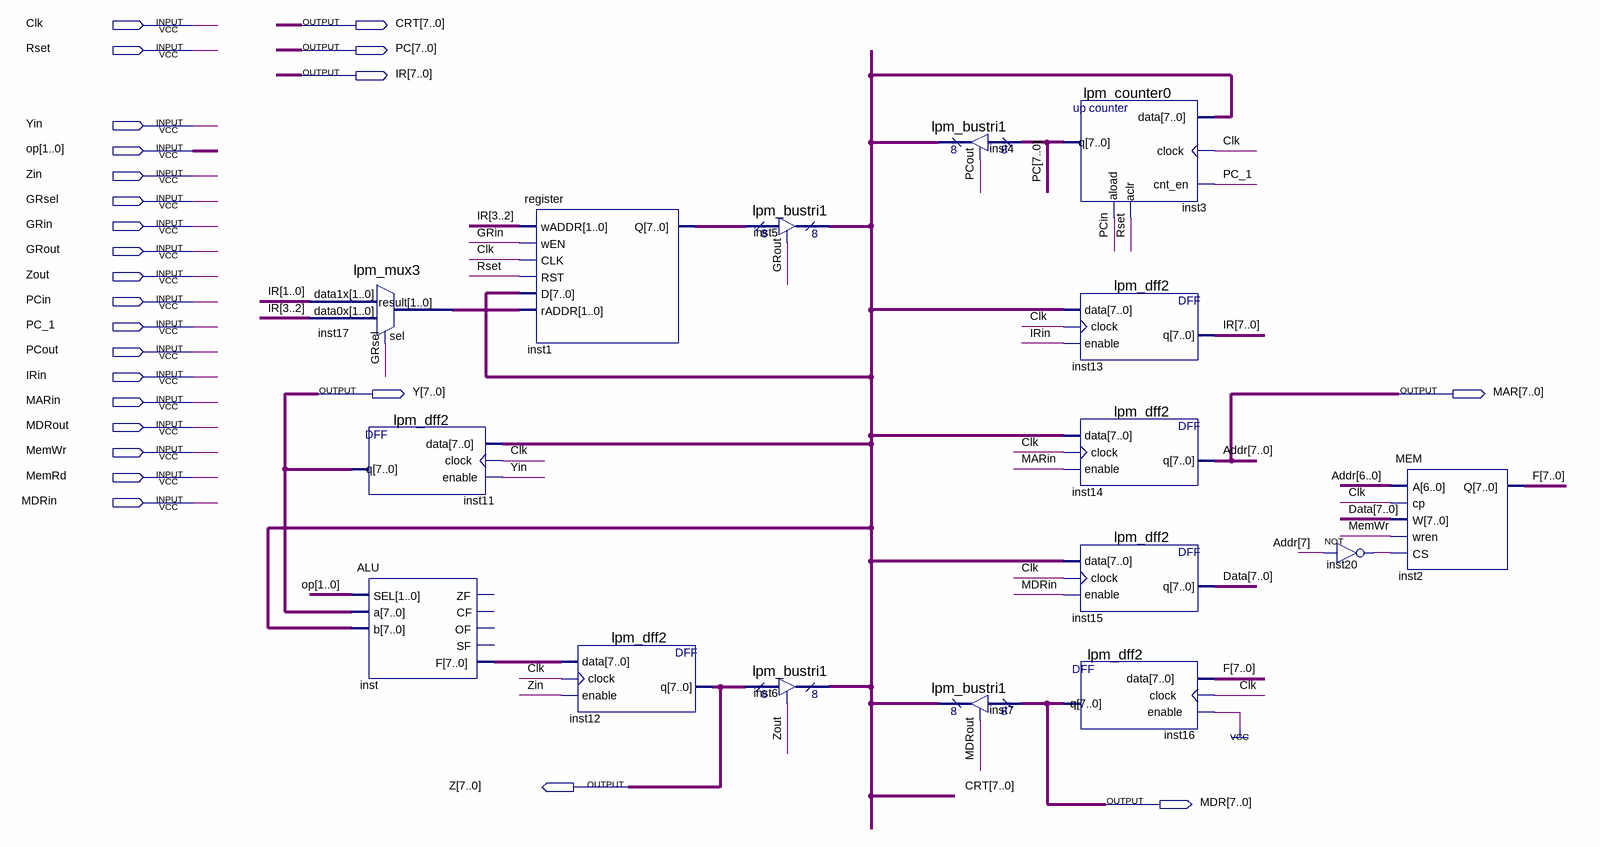
[diagram p0: schematic sheet]
// Quartus schematic DataPath.bdf as structural Verilog: 16 symbols, 25 pins
module DataPath (
  input  Clk,
  input  Rset,
  input  Yin,
  input  [1:0] op,
  input  Zin,
  input  GRsel,
  input  GRin,
  input  GRout,
  input  Zout,
  input  PCin,
  input  PC_1,
  input  PCout,
  input  IRin,
  input  MARin,
  input  MDRout,
  input  MemWr,
  input  MemRd,
  input  MDRin,
  output [7:0] CRT,
  output [7:0] PC,
  output [7:0] IR,
  output [7:0] Y,
  output [7:0] MAR,
  output [7:0] Z,
  output [7:0] MDR
);

  wire inst20_out;
  wire [1:0] inst17_result;
  wire [7:0] Data, F, inst1_q, inst_f;

  lpm_mux3 inst17 (.data1x(IR[1:0]), .data0x(IR[3:2]), .sel(GRsel), .result(inst17_result));
  lpm_dff2 inst11 (.data(CRT), .clock(Clk), .enable(Yin), .q(Y));
  ALU inst (.SEL(op), .a(Y), .b(CRT), .F(inst_f));  // open: ZF, CF, OF, SF
  register inst1 (.wADDR(IR[3:2]), .wEN(GRin), .CLK(Clk), .RST(Rset), .D(CRT), .rADDR(inst17_result), .Q(inst1_q));
  lpm_dff2 inst12 (.data(inst_f), .clock(Clk), .enable(Zin), .q(Z));
  lpm_bustri1 inst5 (.enabledt(GRout), .data(inst1_q), .tridata(CRT));
  lpm_bustri1 inst6 (.enabledt(Zout), .data(Z), .tridata(CRT));
  lpm_bustri1 inst4 (.enabledt(PCout), .data(PC), .tridata(CRT));
  lpm_bustri1 inst7 (.enabledt(MDRout), .data(MDR), .tridata(CRT));
  lpm_counter0 inst3 (.data(CRT), .clock(Clk), .cnt_en(PC_1), .aclr(Rset), .aload(PCin), .q(PC));
  lpm_dff2 inst13 (.data(CRT), .clock(Clk), .enable(IRin), .q(IR));
  lpm_dff2 inst14 (.data(CRT), .clock(Clk), .enable(MARin), .q(MAR));
  lpm_dff2 inst15 (.data(CRT), .clock(Clk), .enable(MDRin), .q(Data));
  lpm_dff2 inst16 (.data(F), .clock(Clk), .enable(1'b1), .q(MDR));
  not inst20 (inst20_out, MAR[7]);
  MEM inst2 (.A(MAR[6:0]), .cp(Clk), .W(Data), .wren(MemWr), .CS(inst20_out), .Q(F));

  // Other names for the same wires on the sheet: Addr[7:0] = MAR
endmodule
